# Altium schematic sheet AGM609MNAAGM609MNA.schdoc
size 127 x 101 mm
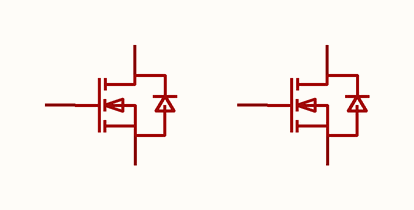
[diagram p0: AGM609MNAAGM609MNA.schdoc]

## Parts
(Parts that share a designator on the sheet are numbered #1, #2 ... from top to bottom, then left to right.)
U?#1  (no value)  (part A of 2)
U?#2  (no value)  (part B of 2)

## Nets

Not connected (* = marked no-connect by the designer): U?#1 1(S1) 2(G1) 6(D1); U?#2 3(S2) 4(G2) 5(D2)

## Library data of the parts
U?#1 U?#2 = AGM609MNA: Symbol: AGM609MNA